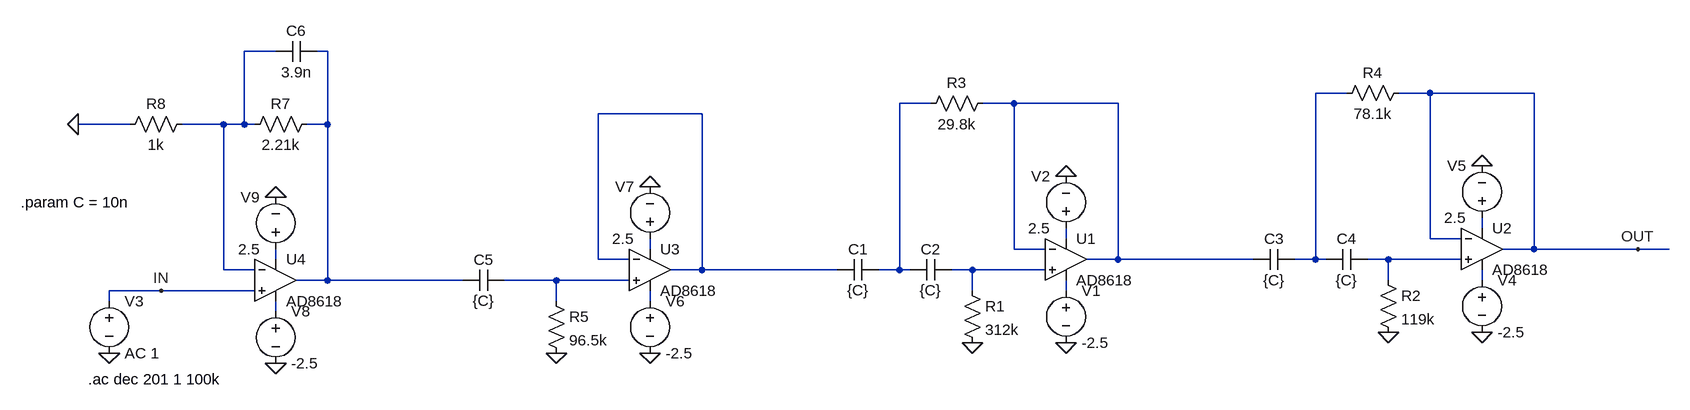
[diagram p0: schematic HighPassFilter.asc]
HighPassFilter.asc, the LTspice schematic file:
Version 4
SHEET 1 2468 1076
WIRE -432 -208 -480 -208
WIRE -352 -208 -368 -208
WIRE 1216 -144 1168 -144
WIRE 1344 -144 1296 -144
WIRE 1504 -144 1344 -144
WIRE 576 -128 528 -128
WIRE 704 -128 656 -128
WIRE 864 -128 704 -128
WIRE 224 -112 64 -112
WIRE -656 -96 -736 -96
WIRE -512 -96 -576 -96
WIRE -480 -96 -480 -208
WIRE -480 -96 -512 -96
WIRE -464 -96 -480 -96
WIRE -352 -96 -352 -208
WIRE -352 -96 -384 -96
WIRE 1424 64 1424 48
WIRE 784 80 784 64
WIRE 1344 80 1344 -144
WIRE 1392 80 1344 80
WIRE 144 96 144 80
WIRE 704 96 704 -128
WIRE 752 96 704 96
WIRE 1504 96 1504 -144
WIRE 1504 96 1456 96
WIRE 1664 96 1504 96
WIRE 1712 96 1664 96
WIRE -432 112 -432 96
WIRE 64 112 64 -112
WIRE 112 112 64 112
WIRE 864 112 864 -128
WIRE 864 112 816 112
WIRE 1072 112 864 112
WIRE 1168 112 1168 -144
WIRE 1168 112 1136 112
WIRE 1184 112 1168 112
WIRE 1280 112 1248 112
WIRE 1392 112 1280 112
WIRE -512 128 -512 -96
WIRE -464 128 -512 128
WIRE 224 128 224 -112
WIRE 224 128 176 128
WIRE 432 128 224 128
WIRE 528 128 528 -128
WIRE 528 128 496 128
WIRE 544 128 528 128
WIRE 640 128 608 128
WIRE 752 128 640 128
WIRE -352 144 -352 -96
WIRE -352 144 -400 144
WIRE -144 144 -352 144
WIRE 0 144 -80 144
WIRE 112 144 0 144
WIRE 1280 144 1280 112
WIRE 1424 144 1424 128
WIRE -608 160 -688 160
WIRE -464 160 -608 160
WIRE 640 160 640 128
WIRE 784 160 784 144
WIRE -688 176 -688 160
WIRE 0 176 0 144
WIRE 144 176 144 160
WIRE -432 192 -432 176
FLAG -688 256 0
FLAG -608 160 IN
FLAG 1424 224 0
FLAG 1424 -32 0
FLAG 1280 224 0
FLAG 784 240 0
FLAG 784 -16 0
FLAG 640 240 0
FLAG 144 256 0
FLAG 144 0 0
FLAG 0 256 0
FLAG -432 272 0
FLAG -432 16 0
FLAG -736 -96 0
FLAG 1664 96 OUT
SYMBOL voltage -688 160 R0
WINDOW 123 24 124 Left 2
WINDOW 39 0 0 Left 0
SYMATTR InstName V3
SYMATTR Value AC 1
SYMBOL Opamps\\AD8618 1424 32 R0
SYMATTR InstName U2
SYMBOL voltage 1424 128 R0
SYMATTR InstName V4
SYMATTR Value -2.5
SYMBOL voltage 1424 64 R180
WINDOW 0 24 96 Left 2
WINDOW 3 24 16 Left 2
SYMATTR InstName V5
SYMATTR Value 2.5
SYMBOL cap 1136 96 R90
WINDOW 0 0 32 VBottom 2
WINDOW 3 32 32 VTop 2
SYMATTR InstName C3
SYMATTR Value {C}
SYMBOL res 1264 128 R0
SYMATTR InstName R2
SYMATTR Value 119k
SYMBOL cap 1248 96 R90
WINDOW 0 0 32 VBottom 2
WINDOW 3 32 32 VTop 2
SYMATTR InstName C4
SYMATTR Value {C}
SYMBOL res 1312 -160 R90
WINDOW 0 0 56 VBottom 2
WINDOW 3 32 56 VTop 2
SYMATTR InstName R4
SYMATTR Value 78.1k
SYMBOL Opamps\\AD8618 784 48 R0
SYMATTR InstName U1
SYMBOL voltage 784 144 R0
SYMATTR InstName V1
SYMATTR Value -2.5
SYMBOL voltage 784 80 R180
WINDOW 0 24 96 Left 2
WINDOW 3 24 16 Left 2
SYMATTR InstName V2
SYMATTR Value 2.5
SYMBOL cap 496 112 R90
WINDOW 0 0 32 VBottom 2
WINDOW 3 32 32 VTop 2
SYMATTR InstName C1
SYMATTR Value {C}
SYMBOL res 624 144 R0
SYMATTR InstName R1
SYMATTR Value 312k
SYMBOL cap 608 112 R90
WINDOW 0 0 32 VBottom 2
WINDOW 3 32 32 VTop 2
SYMATTR InstName C2
SYMATTR Value {C}
SYMBOL res 672 -144 R90
WINDOW 0 0 56 VBottom 2
WINDOW 3 32 56 VTop 2
SYMATTR InstName R3
SYMATTR Value 29.8k
SYMBOL Opamps\\AD8618 144 64 R0
SYMATTR InstName U3
SYMBOL voltage 144 160 R0
SYMATTR InstName V6
SYMATTR Value -2.5
SYMBOL voltage 144 96 R180
WINDOW 0 24 96 Left 2
WINDOW 3 24 16 Left 2
SYMATTR InstName V7
SYMATTR Value 2.5
SYMBOL cap -80 128 R90
WINDOW 0 0 32 VBottom 2
WINDOW 3 32 32 VTop 2
SYMATTR InstName C5
SYMATTR Value {C}
SYMBOL res -16 160 R0
SYMATTR InstName R5
SYMATTR Value 96.5k
SYMBOL Opamps\\AD8618 -432 80 R0
SYMATTR InstName U4
SYMBOL voltage -432 176 R0
SYMATTR InstName V8
SYMATTR Value -2.5
SYMBOL voltage -432 112 R180
WINDOW 0 24 96 Left 2
WINDOW 3 24 16 Left 2
SYMATTR InstName V9
SYMATTR Value 2.5
SYMBOL res -368 -112 R90
WINDOW 0 0 56 VBottom 2
WINDOW 3 32 56 VTop 2
SYMATTR InstName R7
SYMATTR Value 2.21k
SYMBOL res -560 -112 R90
WINDOW 0 0 56 VBottom 2
WINDOW 3 32 56 VTop 2
SYMATTR InstName R8
SYMATTR Value 1k
SYMBOL cap -368 -224 R90
WINDOW 0 0 32 VBottom 2
WINDOW 3 32 32 VTop 2
SYMATTR InstName C6
SYMATTR Value 3.9n
TEXT -720 296 Left 2 !.ac dec 201 1 100k
TEXT -824 24 Left 2 !.param C = 10n

The netlist it stands for:
* HighPassFilter.asc
V3 IN 0 AC 1
XU2 N011 OUT N007 N014 OUT AD8618  ; pins In+ In- V+ V- OUT
V4 N014 0 -2.5
V5 N007 0 2.5
C3 N003 N005 {C}
R2 N011 0 119k
C4 N011 N003 {C}
R4 OUT N003 78.1k
XU1 N012 N005 N008 N015 N005 AD8618  ; pins In+ In- V+ V- OUT
V1 N015 0 -2.5
V2 N008 0 2.5
C1 N004 N006 {C}
R1 N012 0 312k
C2 N012 N004 {C}
R3 N005 N004 29.8k
XU3 N013 N006 N009 N016 N006 AD8618  ; pins In+ In- V+ V- OUT
V6 N016 0 -2.5
V7 N009 0 2.5
C5 N013 N002 {C}
R5 N013 0 96.5k
XU4 IN N001 N010 N017 N002 AD8618  ; pins In+ In- V+ V- OUT
V8 N017 0 -2.5
V9 N010 0 2.5
R7 N002 N001 2.21k
R8 N001 0 1k
C6 N002 N001 3.9n
.ac dec 201 1 100k
.param C = 10n
.backanno
.end